# EasyEDA schematic temperature-box_2020-09-28_12-37-06.json
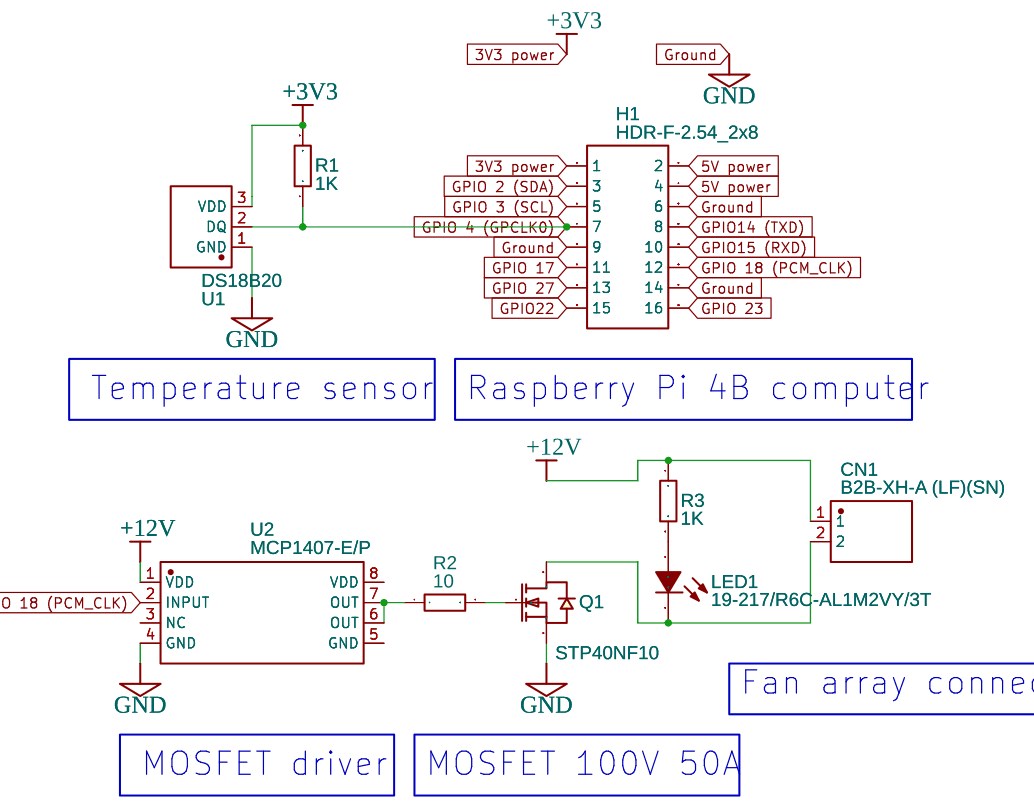
[diagram p0: schematic sheet]

## Parts
CN1  B2B-XH-A (LF)(SN)  [CONN-TH_B2B-XH-A (LF)(SN)]
H1  HDR-F-2.54_2x8  [HDR-F-2.54_2X8]
LED1  19-217/R6C-AL1M2VY/3T  [LED0603-R-RD]
Q1  STP40NF10  [TO-220AB-3_L10.4-W4.6-P2.54-L]
R1  1K  [R0805]
R2  10  [RES-TH_BD2.2-L6.5-P10.50-D0.6]
R3  1K  [RES-TH_BD2.5-L6.5-P10.50-D0.6]
U1  DS18B20  [TO-92-3_L4.9-W3.7-P1.27-L]
U2  MCP1407-E/P  [PDIP-8_L10.2-W5.9-P2.54-LS7.6-BL]

## Library data of the parts
CN1 = B2B-XH-A (LF)(SN): Supplier: LCSC; Supplier Part: C158012; Manufacturer: JST Sales America; Contributor: LCSC
H1 = HDR-F-2.54_2x8: Supplier Part: C30734; Supplier: LCSC; Contributor: LCEDA_Lib
LED1 = 19-217/R6C-AL1M2VY/3T: Supplier: LCSC; Manufacturer: EVERLIGHT; image: //image.lceda.cn/szlcsc/C72044.jpg; Supplier Part: C72044; LCSC Assembly: Yes; SMT Type: Extend
Q1 = STP40NF10: Supplier: LCSC; Supplier Part: C495254; Manufacturer: STMicroelectronics; Contributor: LCSC
R1 = 0805W8F1001T5E: Supplier: LCSC; Manufacturer: UniOhm; LCSC Assembly: Yes; Supplier Part: C17513; SMT Type: Basic
R2 = MFR0W4F100JA50: Supplier: LCSC; Manufacturer: UniOhm; Supplier Part: C57437
R3 = MFR0W4F1001A50: Supplier: LCSC; Manufacturer: UniOhm; Supplier Part: C57435
U1 = DS18B20: Supplier: LCSC; Supplier Part: C376006; Manufacturer: Youtai Semiconductor Co., Ltd.; Contributor: LCSC
U2 = MCP1407-E/P: Supplier: LCSC; Supplier Part: C185573; Manufacturer: Microchip Tech; Contributor: LCSC

## Nets
5V power: H1.2 H1.4
+3V3: H1.1 R1.2 U1.3(VDD)
+12V: CN1.1 R3.1 U2.1(VDD)
GND: H1.6 H1.9 H1.14 Q1.3(S) U1.1(GND) U2.4(GND)
GPIO14 (TXD): H1.8
GPIO15 (RXD): H1.10
GPIO22: H1.15
GPIO 2 (SDA): H1.3
GPIO 3 (SCL): H1.5
GPIO 4 (GPCLK0): H1.7 R1.1 U1.2(DQ)
GPIO 17: H1.11
GPIO 18 (PCM_CLK): H1.12 U2.2(INPUT)
GPIO 23: H1.16
GPIO 27: H1.13
Net-(CN1-2): CN1.2 LED1.2(C) Q1.2(D)
Net-(LED1-1): LED1.1(A) R3.2
Net-(Q1-1): Q1.1(G) R2.2
Net-(R2-1): R2.1 U2.6(OUT) U2.7(OUT)

Not connected (* = marked no-connect by the designer): U2 3(NC) 5(GND) 8(VDD)

## Notes on the sheet
- Temperature sensor
- Raspberry Pi 4B computer
- Fan array connector
- MOSFET driver
- MOSFET 100V 50A
